# EasyEDA Pro project Instruction_Register.eprj

# Schematic Schematic2
Board Name: Board2; Create Date: 2025-08-15; Page Name: P1; Project Name: Instruction_Register; Schematic Name: Schematic2; Update Date: 2025-08-15; Company: EasyEDA.com; Page Size: A4; Version: V1.0
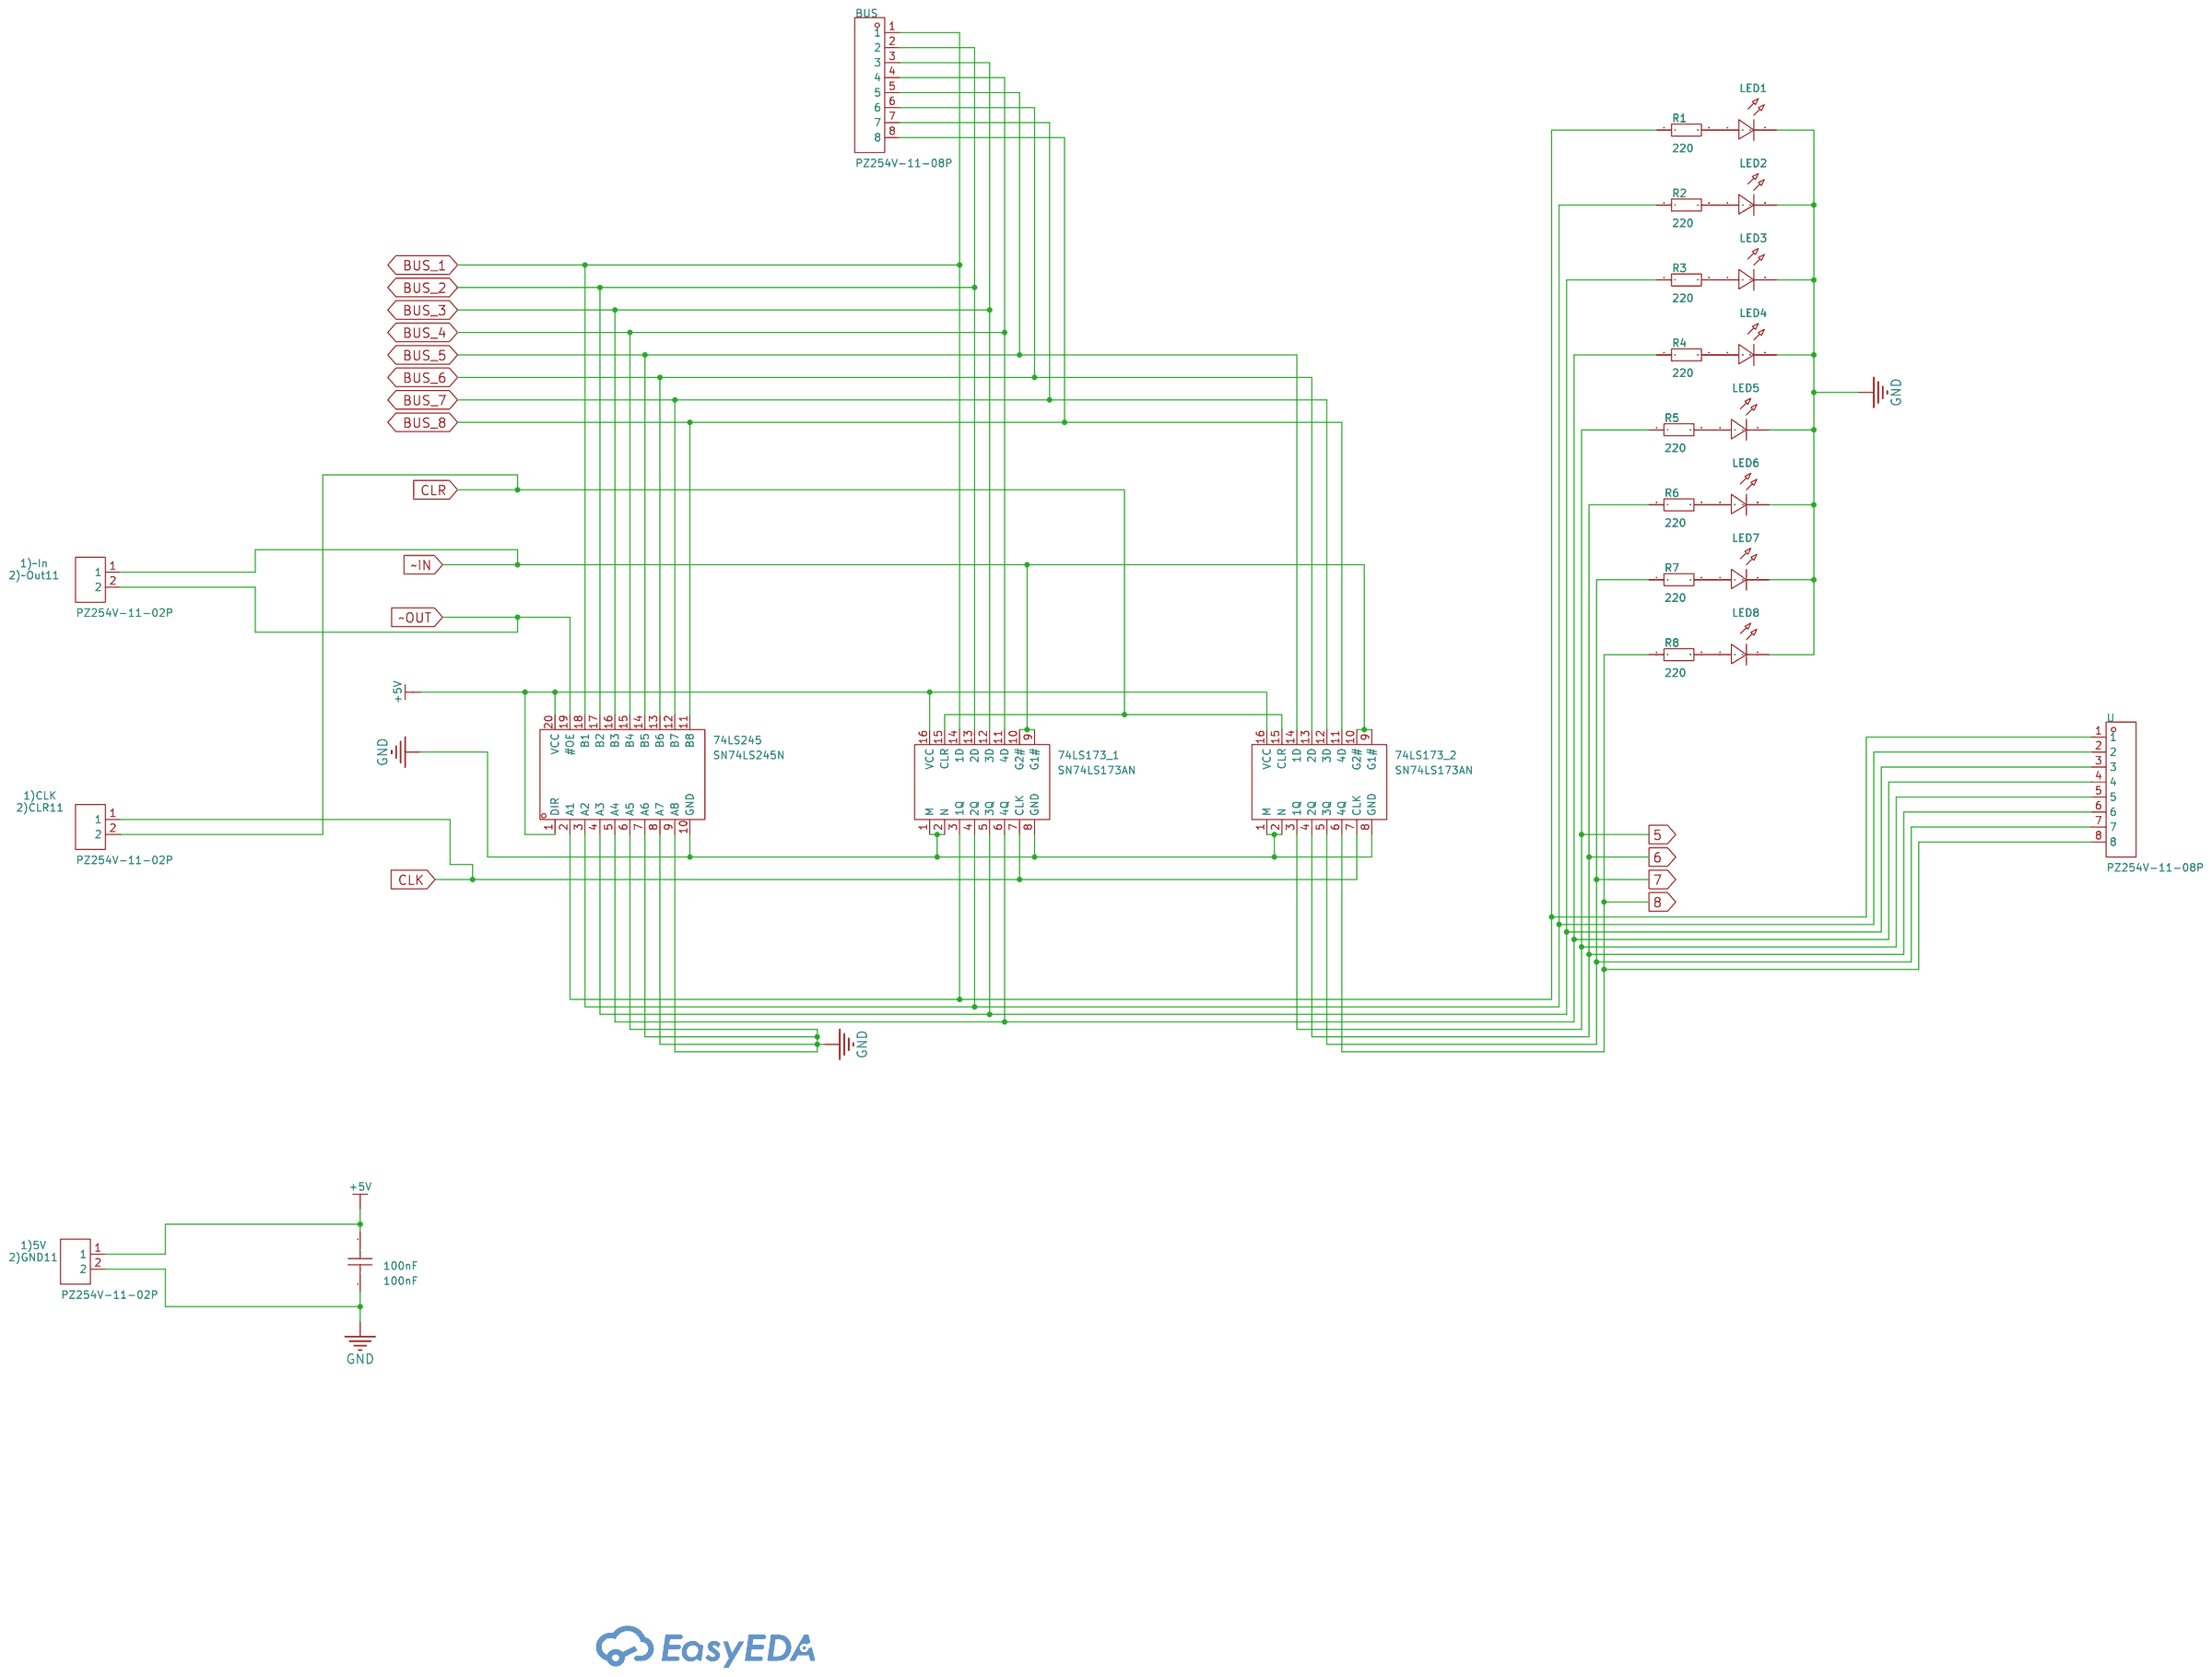
[diagram p0: schematic sheet]

## Parts
1)5V
2)GND11  PZ254V-11-02P  [HDR-TH_2P-P2.54-V-M]
1)CLK
2)CLR11  PZ254V-11-02P  [HDR-TH_2P-P2.54-V-M]
1)~In
2)~Out11  PZ254V-11-02P  [HDR-TH_2P-P2.54-V-M]
74LS173_1  SN74LS173AN  [PDIP-16_L19.3-W6.4-P2.54-LS7.94-BL]
74LS173_2  SN74LS173AN  [PDIP-16_L19.3-W6.4-P2.54-LS7.94-BL]
74LS245  SN74LS245N  [DIP-20_L25.5-W10.0-P2.54-LS7.6-BL]
100nF  100nF  [CAP-TH_L8.5-W5.0-P5.00-D1.2]
BUS  PZ254V-11-08P  [HDR-TH_8P-P2.54-V-M]
LED1  -  [LED-TH_BD5.8-P2.54-FD]
LED2  -  [LED-TH_BD5.8-P2.54-FD]
LED3  -  [LED-TH_BD5.8-P2.54-FD]
LED4  -  [LED-TH_BD5.8-P2.54-FD]
LED5  -  [LED-TH_BD5.8-P2.54-FD]
LED6  -  [LED-TH_BD5.8-P2.54-FD]
LED7  -  [LED-TH_BD5.8-P2.54-FD]
LED8  -  [LED-TH_BD5.8-P2.54-FD]
R1  220  [R_AXIAL-0.4]
R2  220  [R_AXIAL-0.4]
R3  220  [R_AXIAL-0.4]
R4  220  [R_AXIAL-0.4]
R5  220  [R_AXIAL-0.4]
R6  220  [R_AXIAL-0.4]
R7  220  [R_AXIAL-0.4]
R8  220  [R_AXIAL-0.4]
U  PZ254V-11-08P  [HDR-TH_8P-P2.54-V-M]

## Library data of the parts
1)5V
2)GND11 1)CLK
2)CLR11 1)~In
2)~Out11 = PZ254V-11-02P: Pin Structure:1x2P Pitch:2.54mm Row Spacing:- Circluar Pins/Square Pins:Policy Mounting Type:Straight Number of Rows:Single Row Number of Pins:2P Current Rating:- Voltage Rating (Max):- Length of Mating Pin:6mm Insulation Height:2.5mm Length of End Connec; LCSC Part Name: 1x2P 间距:2.54mm 方针 直插; Supplier Part: C492401; Manufacturer: XFCN(兴飞); Supplier Footprint: 插件,P=2.54mm; JLCPCB Part Class: Extended Part; Datasheet: https://atta.szlcsc.com/upload/public/pdf/source/20200309/C492401_A812433581A9B211A7FFA413ADDFF0E5.pdf; Supplier: LCSC; Pin Structure: 1x2P; Pitch: 2.54mm; Circluar Pins/Square Pins: Policy; Mounting Type: Straight; Number of Rows: Single Row; Number of Pins: 2P; Length of Mating Pin: 6mm; Insulation Height: 2.5mm; Length of End Connection Pin: 3mm; Contact Material: Brass; Operating Temperature: -40℃~+105℃; Color: Black
74LS173_1 74LS173_2 = SN74LS173AN: Type:D-Type Trigger Type:Rising Edge Voltage - Supply:4.75V~5.25V Voltage - Supply:4.75V~5.25V Clock Frequency:50MHz Function:Reset Number of Elements:1 Number of Bits per Element:4 Output Type:- Propagation Delay:30ns@5V,45pF Series:74LS Series Current -; Supplier Part: C1550125; Manufacturer: TI(德州仪器); Supplier Footprint: PDIP-16; JLCPCB Part Class: Extended Part; Datasheet: https://www.ti.com/cn/lit/gpn/sn74ls173a; Supplier: LCSC; Type: D-Type; Trigger Type: Rising Edge; Voltage - Supply: 4.75V~5.25V; Clock Frequency: 50MHz; Function: Reset; Number of Elements: 1; Number of Bits per Element: 4; Propagation Delay: 30ns@5V,45pF; Series: 74LS Series; Current - Output Low(IOL): 24mA; Current - Output High(IOH): 2.6mA; Quiescent Current: 24mA; Operating Temperature: 0℃~+70℃
74LS245 = SN74LS245N: output type:Tri-State Voltage - Supply:4.75V~5.25V Voltage - Supply:4.75V~5.25V Number of Elements:1 Number of Bits per Element:8 Current - Output Low(IOL):24mA Current - Output High(IOH):15mA Logic Family:74LS Operating Temperature:0℃~+70℃ Operating Temp; Supplier Part: C352966; Manufacturer: TI(德州仪器); Supplier Footprint: DIP-20; JLCPCB Part Class: Extended Part; Datasheet: https://www.ti.com/cn/lit/gpn/sn74ls245; Supplier: LCSC; output type: Tri-State; Voltage - Supply: 4.75V~5.25V; Number of Elements: 1; Number of Bits per Element: 8; Current - Output Low(IOL): 24mA; Current - Output High(IOH): 15mA; Logic Family: 74LS; Operating Temperature: 0℃~+70℃
100nF = CT4-0805B104K500F3: Capacitance:100nF Tolerance:±10% Tolerance:±10% Voltage Rated: Temperature Coefficient:; LCSC Part Name: 100nF ±10% 50V C3型（直脚）; Supplier Part: C84772; Manufacturer: FH(风华); Supplier Footprint: 插件,P=5.08mm; JLCPCB Part Class: Extended Part; Datasheet: https://atta.szlcsc.com/upload/public/pdf/source/20190402/C385200_059806A6312B28FF1421A2413EB641E1.pdf; Supplier: LCSC; Tolerance: ±10%
BUS U = PZ254V-11-08P: Pin Structure:1x8P Pitch:2.54mm Row Spacing:- Circluar Pins/Square Pins:Square Pins Mounting Type:Straight Number of Rows:Plugin Number of Pins:8P Current Rating (Max):- Voltage Rating (Max):- Length of Mating Pin:6mm Insulation Height:2.5mm Length of End; LCSC Part Name: 间距:2.54mm 1x8P 直插 方针; Supplier Part: C492407; Manufacturer: XFCN(兴飞); Supplier Footprint: 插件,P=2.54mm; JLCPCB Part Class: Extended Part; Datasheet: https://atta.szlcsc.com/upload/public/pdf/source/20200309/C492407_83A6FB26A2233368EDB9516968EC6149.pdf; Supplier: LCSC; Pin Structure: 1x8P; Pitch: 2.54mm; Circluar Pins/Square Pins: Square Pins; Mounting Type: Straight; Number of Rows: Plugin; Number of Pins: 8P; Length of Mating Pin: 6mm; Insulation Height: 2.5mm; Length of End Connection Pin: 3mm; Operating Temperature Range: -40℃~+105℃; Color: Black
LED1-LED8 = LED_TH-R_5mm: Supplier Footprint: Through
R1-R8 = Res_AXIAL-1/4W: Supplier Footprint: Through

## Nets
+5V: 1)5V
2)GND11.1 74LS173_1.16(VCC) 74LS173_2.16(VCC) 74LS245.1(DIR) 74LS245.20(VCC) 100nF.1
GND: 1)5V
2)GND11.2 74LS173_1.1(M) 74LS173_1.2(N) 74LS173_1.8(GND) 74LS173_2.1(M) 74LS173_2.2(N) 74LS173_2.8(GND) 74LS245.6(A5) 74LS245.7(A6) 74LS245.8(A7) 74LS245.9(A8) 74LS245.10(GND) 100nF.2 LED1.2(A) LED2.2(A) LED3.2(A) LED4.2(A) LED5.2(A) LED6.2(A) LED7.2(A) LED8.2(A)
5: 74LS173_2.3(1Q) R5.1 U.5
6: 74LS173_2.4(2Q) R6.1 U.6
7: 74LS173_2.5(3Q) R7.1 U.7
8: 74LS173_2.6(4Q) R8.1 U.8
BUS_1: 74LS173_1.14(1D) 74LS245.18(B1) BUS.1
BUS_2: 74LS173_1.13(2D) 74LS245.17(B2) BUS.2
BUS_3: 74LS173_1.12(3D) 74LS245.16(B3) BUS.3
BUS_4: 74LS173_1.11(4D) 74LS245.15(B4) BUS.4
BUS_5: 74LS173_2.14(1D) 74LS245.14(B5) BUS.5
BUS_6: 74LS173_2.13(2D) 74LS245.13(B6) BUS.6
BUS_7: 74LS173_2.12(3D) 74LS245.12(B7) BUS.7
BUS_8: 74LS173_2.11(4D) 74LS245.11(B8) BUS.8
CLK: 1)CLK
2)CLR11.1 74LS173_1.7(CLK) 74LS173_2.7(CLK)
CLR: 1)CLK
2)CLR11.2 74LS173_1.15(CLR) 74LS173_2.15(CLR)
~IN: 1)~In
2)~Out11.1 74LS173_1.9(G1#) 74LS173_1.10(G2#) 74LS173_2.9(G1#) 74LS173_2.10(G2#)
~OUT: 1)~In
2)~Out11.2 74LS245.19(#OE)
$1N2512: LED1.1(C) R1.2
$1N2517: 74LS173_1.6(4Q) 74LS245.5(A4) R4.1 U.4
$1N2518: 74LS173_1.5(3Q) 74LS245.4(A3) R3.1 U.3
$1N2519: 74LS173_1.4(2Q) 74LS245.3(A2) R2.1 U.2
$1N2520: 74LS173_1.3(1Q) 74LS245.2(A1) R1.1 U.1
$1N2521: LED8.1(C) R8.2
$1N2522: LED7.1(C) R7.2
$1N2523: LED6.1(C) R6.2
$1N2524: LED5.1(C) R5.2
$1N2525: LED4.1(C) R4.2
$1N2526: LED3.1(C) R3.2
$1N2527: LED2.1(C) R2.2

# Board PCB2
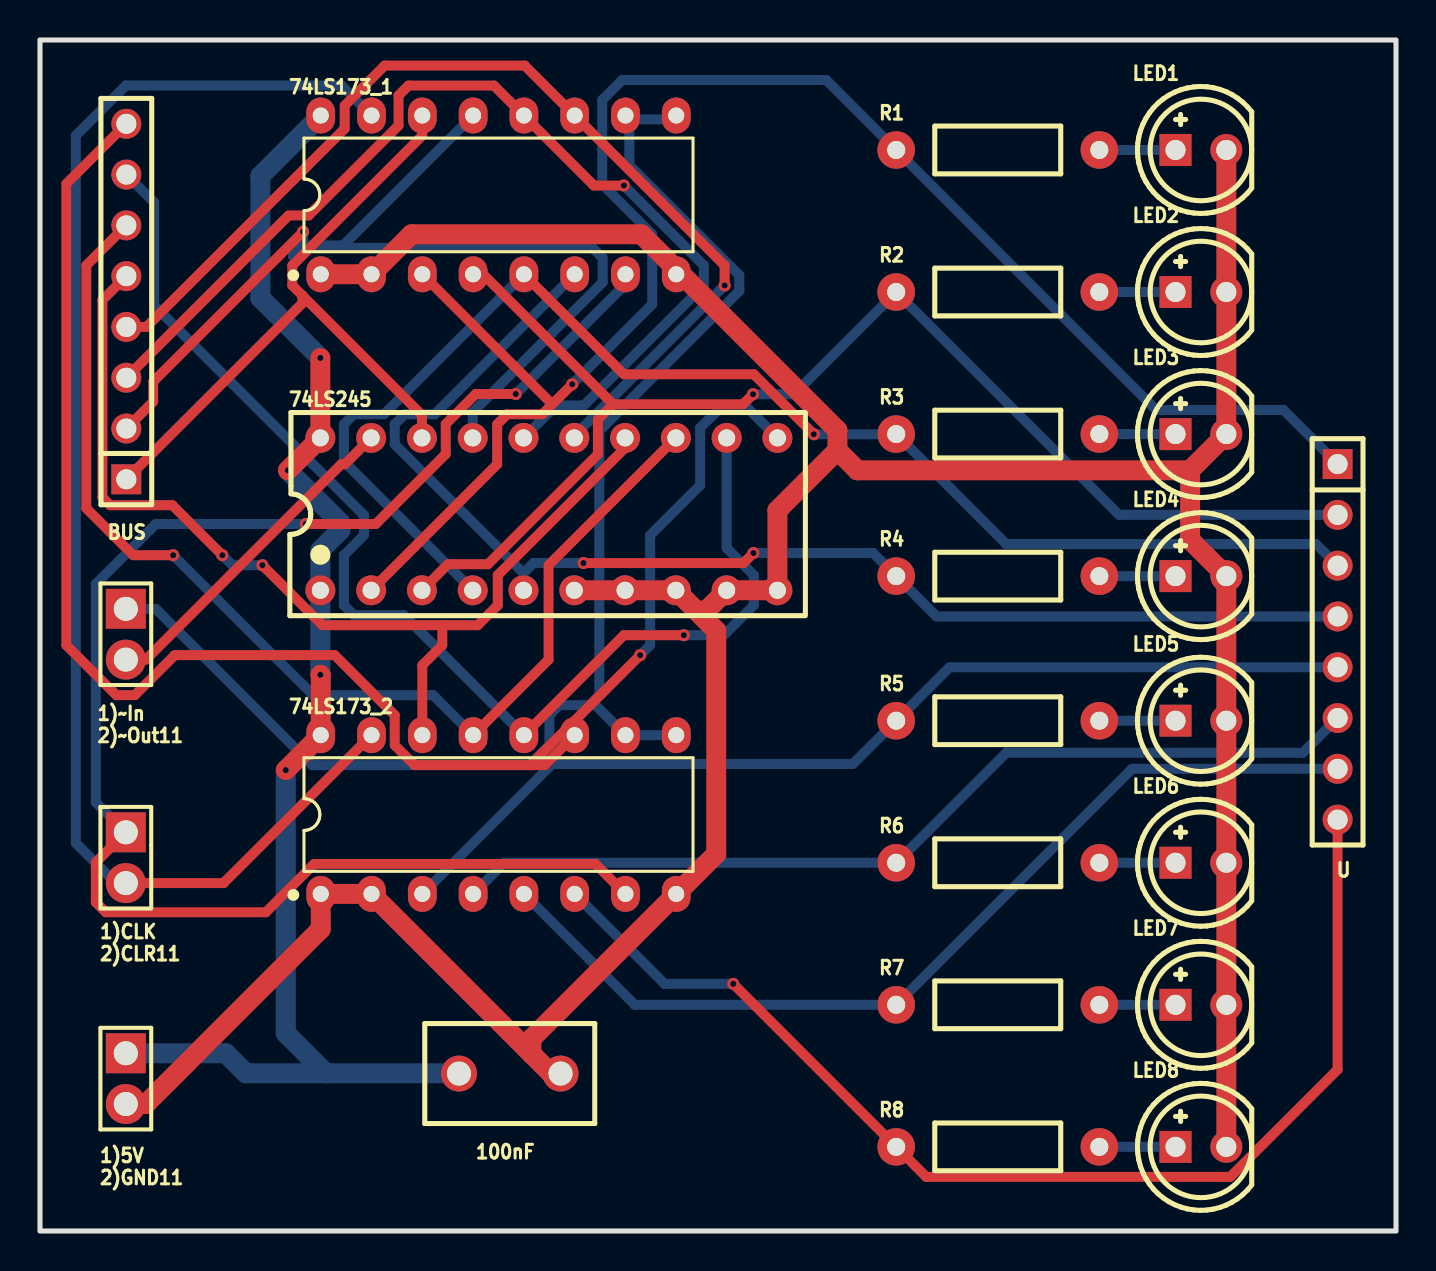
[diagram p1: board, top side]
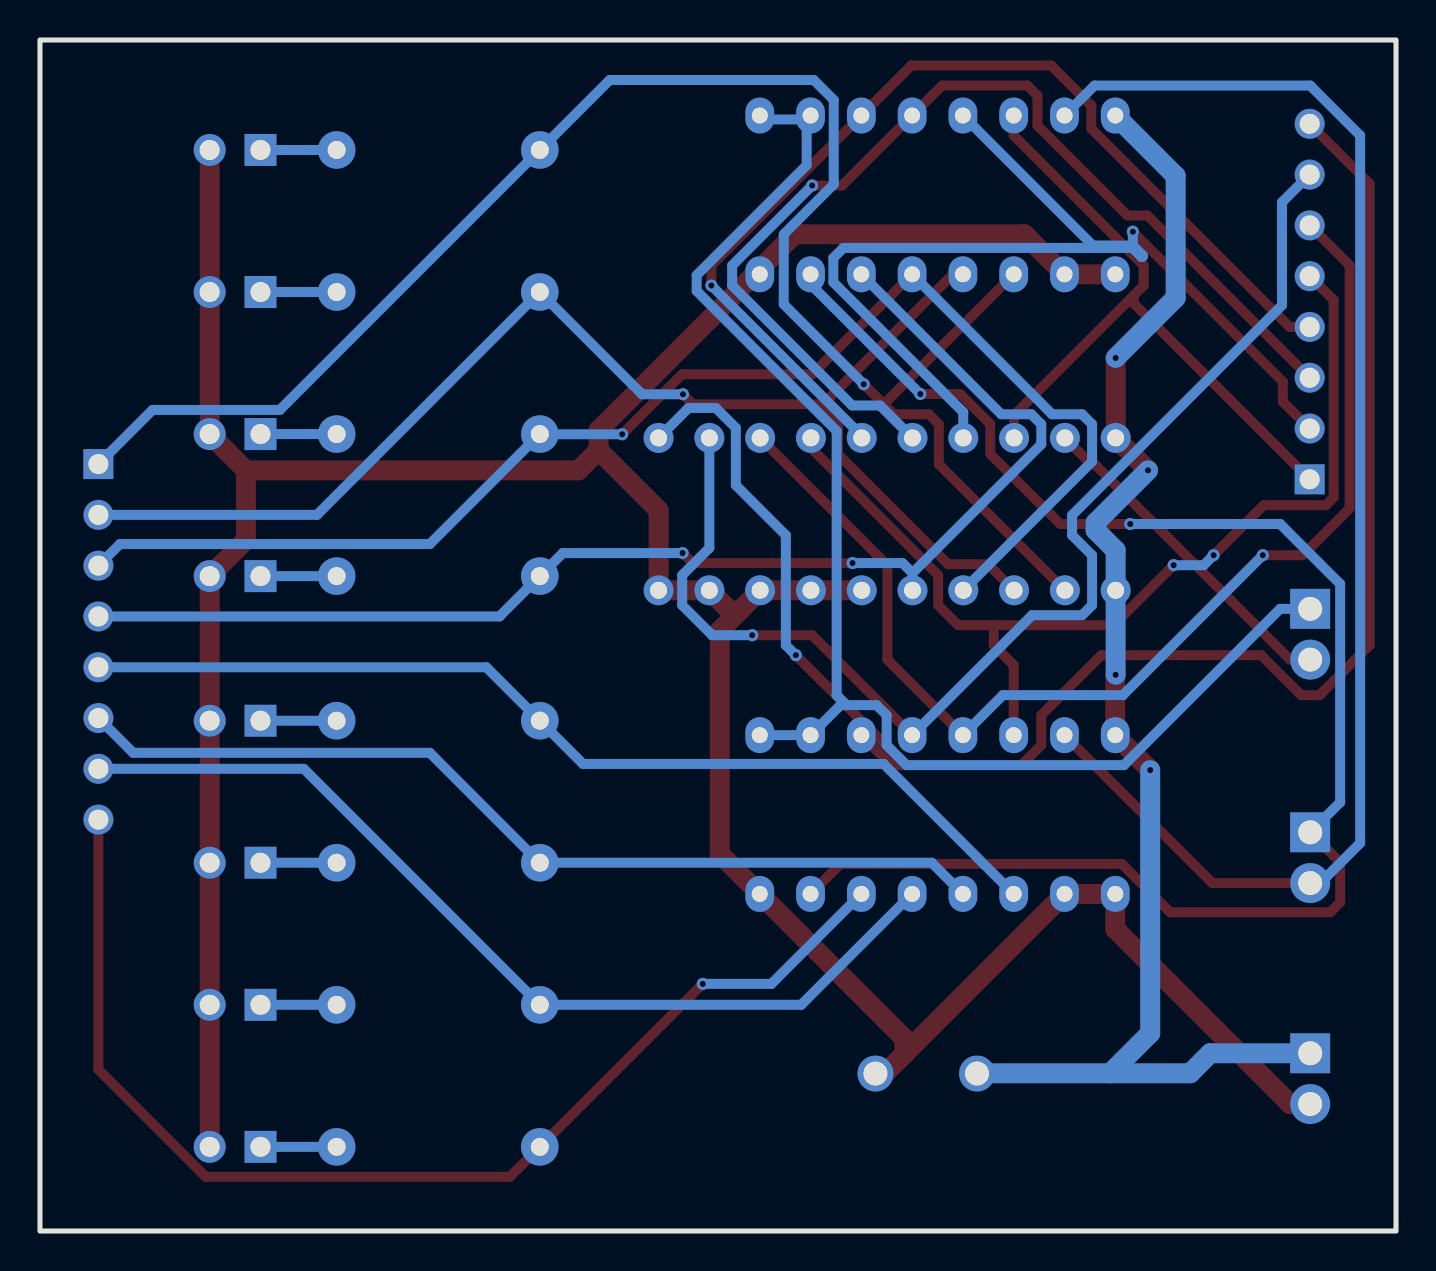
[diagram p2: board, bottom side, seen from below]

Outline 67.82 x 59.56 mm; copper layers: Top Layer, Bottom Layer. Coordinates in mm from the lower left corner of the outline.
Outline path: rectangle 0,59.56 67.82,0
Stack: Top Layer 0.035mm / Dielectric1 1.51mm FR4 er 4.5 / Bottom Layer 0.035mm

## Design rules (mm)
template: Custom Config
spacing copperThickness1oz (default): track to track 0.102, other pairs 0.152 to 0.3
spacing copperThickness2oz: track to track 0.203, other pairs 0.152 to 0.3
track width copperThickness1oz (default): min 0.127, default 0.5, max 2.54
track width copperThickness2oz: min 0.203, default 1, max 2.54
differential pair differentialPair (default): width min 0.127, default 0.254, max 2.54; gap min 0.152, default 0.152
via viaSize (default): diameter min 0.5, default 0.61, max 10; hole min 0.3, default 0.305, max 6.3
net +5V uses copperThickness2oz
net GND uses copperThickness2oz

## Placement (name value [footprint] x y rotation side)
1)5V
2)GND11  PZ254V-11-02P  [HDR-TH_2P-P2.54-V-M]  4.29 7.62 270 top
1)CLK
2)CLR11  PZ254V-11-02P  [HDR-TH_2P-P2.54-V-M]  4.29 18.67 270 top
1)~In
2)~Out11  PZ254V-11-02P  [HDR-TH_2P-P2.54-V-M]  4.29 29.84 270 top
74LS173_1  SN74LS173AN  [PDIP-16_L19.3-W6.4-P2.54-LS7.94-BL]  22.93 51.82 0 top
74LS173_2  SN74LS173AN  [PDIP-16_L19.3-W6.4-P2.54-LS7.94-BL]  22.93 20.83 0 top
74LS245  SN74LS245N  [DIP-20_L25.5-W10.0-P2.54-LS7.6-BL]  25.45 35.85 0 top
100nF  100nF  [CAP-TH_L8.5-W5.0-P5.00-D1.2]  23.5 7.87 0 top
BUS  PZ254V-11-08P  [HDR-TH_8P-P2.54-V-M]  4.32 46.48 90 top
LED1  -  [LED-TH_BD5.8-P2.54-FD]  58.06 54.06 0 top
LED2  -  [LED-TH_BD5.8-P2.54-FD]  58.06 46.96 0 top
LED3  -  [LED-TH_BD5.8-P2.54-FD]  58.06 39.85 0 top
LED4  -  [LED-TH_BD5.8-P2.54-FD]  58.06 32.75 0 top
LED5  -  [LED-TH_BD5.8-P2.54-FD]  58.06 25.52 0 top
LED6  -  [LED-TH_BD5.8-P2.54-FD]  58.06 18.42 0 top
LED7  -  [LED-TH_BD5.8-P2.54-FD]  58.06 11.31 0 top
LED8  -  [LED-TH_BD5.8-P2.54-FD]  58.06 4.21 0 top
R1  220  [R_AXIAL-0.4]  47.9 54.06 0 top
R2  220  [R_AXIAL-0.4]  47.9 46.96 0 top
R3  220  [R_AXIAL-0.4]  47.9 39.85 0 top
R4  220  [R_AXIAL-0.4]  47.9 32.75 0 top
R5  220  [R_AXIAL-0.4]  47.9 25.52 0 top
R6  220  [R_AXIAL-0.4]  47.9 18.42 0 top
R7  220  [R_AXIAL-0.4]  47.9 11.31 0 top
R8  220  [R_AXIAL-0.4]  47.9 4.21 0 top
U  PZ254V-11-08P  [HDR-TH_8P-P2.54-V-M]  64.9 29.46 270 top

## Footprints (pads in the part's own frame, mm; a bottom-side part is the same pattern mirrored in y, then rotated)
CAP-TH_L8.5-W5.0-P5.00-D1.2
  round 1.8 hole 1.2: 1(-2.54,0) 2(2.54,0)
DIP-20_L25.5-W10.0-P2.54-LS7.6-BL
  round 1.5 hole 0.85: 1(-11.43,-3.81) 2(-8.89,-3.81) 3(-6.35,-3.81) 4(-3.81,-3.81) 5(-1.27,-3.81) 6(1.27,-3.81) 7(3.81,-3.81) 8(6.35,-3.81) 9(8.89,-3.81) 10(11.43,-3.81) 11(11.43,3.81) 12(8.89,3.81) 13(6.35,3.81) 14(3.81,3.81) 15(1.27,3.81) 16(-1.27,3.81) 17(-3.81,3.81) 18(-6.35,3.81) 19(-8.89,3.81) 20(-11.43,3.81)
HDR-TH_2P-P2.54-V-M
  rect 2x2 hole 1.2: 1(-1.27,0)
  round 2 hole 1.2: 2(1.27,0)
HDR-TH_8P-P2.54-V-M
  rect 1.5x1.5 hole 1: 1(-8.89,0)
  round 1.5 hole 1: 2(-6.35,0) 3(-3.81,0) 4(-1.27,0) 5(1.27,0) 6(3.81,0) 7(6.35,0) 8(8.89,0)
LED-TH_BD5.8-P2.54-FD
  rect 1.6x1.6 hole 1: 1(-1.27,0)
  round 1.6 hole 1: 2(1.27,0)
PDIP-16_L19.3-W6.4-P2.54-LS7.94-BL
  oval 1.44x1.8 hole 0.8: 1(-8.89,-3.97) 2(-6.35,-3.97) 3(-3.81,-3.97) 4(-1.27,-3.97) 5(1.27,-3.97) 6(3.81,-3.97) 7(6.35,-3.97) 8(8.89,-3.97) 9(8.89,3.97) 10(6.35,3.97) 11(3.81,3.97) 12(1.27,3.97) 13(-1.27,3.97) 14(-3.81,3.97) 15(-6.35,3.97) 16(-8.89,3.97)
R_AXIAL-0.4
  round 1.879 hole 0.899: 1(-5.08,0) 2(5.08,0)

## Nets
As in the schematic.

## Via types
v1: diameter 0.61, hole 0.305, Top Layer to Bottom Layer, 20 vias

## Routing (per net, layer and track width the routed paths; a pad name or vN(x,y) marks a point on that pad's centre or on a via; arc(x,y) is an arc through that point)
+5V: length 71.2
  Top Layer w1: v1(12.4,38.04) 74LS245.20 v1(14.02,43.66) ; v1(14.02,27.82) 14.04,27.8 74LS173_2.16 v1(12.29,23.05)
  Bottom Layer w1: v1(12.29,23.05) 12.29,9.89 14.29,7.89 ; 14.29,7.89 10.29,7.89 9.29,8.89 1)5V
2)GND11.1 ; 14.29,7.89 20.94,7.89 100nF.1 ; v1(12.4,38.04) 15.02,35.42 15.02,35.04 14.02,34.04 74LS245.1 v1(14.02,27.82) ; 74LS173_1.16 11.02,52.77 11.02,46.66 v1(14.02,43.66)
GND: length 177.9
  Top Layer w1: LED8.2 LED7.2 LED6.2 LED5.2 LED4.2 57.52,34.56 57.52,38.04 ; 24.58,8.86 24.58,9.62 74LS173_2.8 33.82,18.86 33.82,30.02 32.82,31.02 ; 24.58,8.86 74LS173_2.2 74LS173_2.1 14.04,15.1 5.29,6.35 1)5V
2)GND11.2 ; 24.58,8.86 25.56,7.87 100nF.2 ; 32.82,31.02 74LS245.8 74LS245.7 74LS245.6 ; 32.82,31.02 33.32,31.02 74LS245.9 74LS245.10 36.88,36.04 39.88,39.04 ; 39.88,39.04 40.88,38.04 57.52,38.04 ; 39.88,39.04 39.88,40.04 32.08,47.85 ; 32.08,47.85 74LS173_1.8 ; 32.08,47.85 30.08,49.85 18.58,49.85 74LS173_1.2 74LS173_1.1 ; 57.52,38.04 LED3.2 LED2.2 LED1.2
5: length 50.5
  Bottom Layer w0.5: 74LS173_2.3 25.62,23.36 40.66,23.36 R5.1 45.5,28.19 U.5
6: length 46.9
  Bottom Layer w0.5: 74LS173_2.4 23.22,18.42 R6.1 48.32,23.92 63.16,23.92 U.6
7: length 47.9
  Bottom Layer w0.5: U.7 54.62,23.11 R7.1 29.75,11.31 74LS173_2.5
8: length 58.7
  Top Layer w0.5: v1(34.67,12.36) R8.1 44.32,2.71 59.53,2.71 64.9,8.07 U.8
  Bottom Layer w0.5: 74LS173_2.6 31.24,12.36 v1(34.67,12.36)
BUS_1: length 34.3
  Top Layer w0.5: 74LS245.18 19.1,40.8 13.12,46.79 ; 74LS173_1.14 19.12,54.79 12.62,48.29 12.62,47.29 13.12,46.79 ; 13.12,46.79 13.12,46.39 BUS.1
BUS_2: length 53.9
  Top Layer w0.5: BUS.2 5.66,41.47 5.66,42.47 v1(13.16,49.97)
  Bottom Layer w0.5: 13.16,49.14 13.18,49.16 27.64,49.16 28.14,48.66 28.14,47.45 21.64,40.95 74LS245.17 ; 13.16,49.14 12.74,48.72 12.69,48.72 12.66,48.74 12.66,48.79 13.16,49.29 ; 13.16,49.14 13.16,49.29 ; 13.16,49.29 v1(13.16,49.97) ; 13.16,49.29 15.16,49.29 74LS173_1.13
BUS_3: length 52.7
  Top Layer w0.5: BUS.3 12.43,50.79 13.43,50.79 17.93,55.29 17.93,56.79 18.43,57.29 22.7,57.29 74LS173_1.12 27.7,52.29 v1(29.2,52.29)
  Bottom Layer w0.5: v1(29.2,52.29) 33.2,48.29 33.2,47.29 27.2,41.29 25.8,41.29 74LS245.16
BUS_4: length 51.9
  Top Layer w0.5: v1(34.24,47.29) 34.24,48.29 74LS173_1.11 24.24,58.29 17.24,58.29 15.24,56.29 15.24,55.13 5.32,45.21 BUS.4
  Bottom Layer w0.5: 74LS245.15 26.72,39.77 v1(34.24,47.29)
BUS_5: length 51.3
  Top Layer w0.5: v1(11.12,33.3) 14.12,30.3 20.12,30.3 ; 20.12,30.3 20.12,29.3 19.12,28.3 74LS173_2.14 ; 20.12,30.3 21.9,30.3 22.9,31.3 22.9,32.8 29.26,39.16 74LS245.14 ; v1(9.12,33.8) 6.62,36.3 3.51,36.3 3.12,36.69 3.12,46.55 BUS.5
  Bottom Layer w0.5: v1(11.12,33.3) 9.62,33.3 v1(9.12,33.8)
BUS_6: length 58.1
  Top Layer w0.5: v1(6.66,33.8) 4.66,33.8 2.32,36.14 2.32,48.29 BUS.6 ; 74LS173_2.13 25.44,28.57 25.44,33.3 74LS245.13
  Bottom Layer w0.5: v1(6.66,33.8) 13.66,26.8 19.66,26.8 74LS173_2.13
BUS_7: length 61.7
  Top Layer w0.5: 74LS173_2.12 29.2,29.8 v1(32.2,29.8)
  Bottom Layer w0.5: BUS.7 5.7,51.45 5.7,46.3 16.2,35.8 16.2,34.8 15.2,33.8 15.2,31.3 15.7,30.8 18.2,30.8 74LS173_2.12 ; v1(32.2,29.8) 34.2,29.8 35.7,31.3 35.7,32.8 34.34,34.16 74LS245.12
BUS_8: length 83.7
  Top Layer w0.5: 24.52,23.3 v1(30.02,28.8) ; 24.52,23.3 25.24,23.3 74LS173_2.11 ; 24.52,23.3 18.74,23.3 17.74,24.3 17.74,25.8 14.74,28.8 6.74,28.8 4.74,26.8 3.82,26.8 1.32,29.3 1.32,52.37 BUS.8
  Bottom Layer w0.5: 74LS245.11 35.38,41.16 34.02,41.16 33.02,40.16 33.02,37.3 30.52,34.8 30.52,29.3 v1(30.02,28.8)
CLK: length 79.6
  Top Layer w0.5: 1)CLK
2)CLR11.1 2.79,18.44 2.79,16.44 3.29,15.94 11.29,15.94 13.71,18.36 27.78,18.36 74LS173_2.7 ; v1(23.79,41.86) 21.79,41.86 20.29,40.36 20.29,38.86 16.79,35.36 v1(13.29,35.36)
  Bottom Layer w0.5: v1(13.29,35.36) 5.79,35.36 2.79,32.36 2.79,21.44 1)CLK
2)CLR11.1 ; v1(23.79,41.86) 29.28,47.35 74LS173_1.7
CLR: length 70.5
  Top Layer w0.5: 1)CLK
2)CLR11.2 9.18,17.4 74LS173_2.15
  Bottom Layer w0.5: 1)CLK
2)CLR11.2 3.79,17.4 1.79,19.4 1.79,54.79 4.29,57.29 15.08,57.29 74LS173_1.15
~IN: length 70.9
  Bottom Layer w0.5: 27.48,26.3 25.98,26.3 25.48,25.8 25.48,24.3 24.48,23.3 13.61,23.3 5.79,31.11 1)~In
2)~Out11.1 ; 27.48,26.3 27.98,26.8 27.98,40.01 34.98,47.01 34.98,47.8 29.48,53.3 29.48,55.59 ; 27.48,26.3 27.78,26.3 74LS173_2.10 74LS173_2.9 ; 74LS173_1.9 31.63,55.59 29.48,55.59 ; 29.48,55.59 74LS173_1.10
~OUT: length 16.9
  Top Layer w0.5: 74LS245.19 15.24,38.34 15.06,38.34 5.29,28.58 1)~In
2)~Out11.2
$1N2512: length 3.8
  Bottom Layer w0.5: LED1.1 R1.2
$1N2517: length 65.5
  Top Layer w0.5: v1(27.18,33.41) 35.18,33.41 v1(35.68,33.91)
  Bottom Layer w0.5: 24.18,32.91 17.74,39.35 17.74,40.35 18.24,40.85 19.74,40.85 74LS173_1.6 ; 24.18,32.91 24.68,33.41 v1(27.18,33.41) ; 24.18,32.91 74LS245.5 ; v1(35.68,33.91) 41.67,33.91 R4.1 44.84,30.73 U.4
$1N2518: length 69.8
  Top Layer w0.5: v1(38.7,39.85) 35.7,42.85 29.2,42.85 74LS173_1.5
  Bottom Layer w0.5: U.3 63.82,34.35 48.32,34.35 R3.1 42.81,39.85 v1(38.7,39.85) ; 74LS245.4 15.2,38.48 15.2,40.35 15.7,40.85 17.2,40.85 74LS173_1.5
$1N2519: length 67.3
  Top Layer w0.5: 74LS173_1.4 22.16,47.85 28.66,41.35 ; 28.66,41.35 27.9,40.59 27.9,38.85 22.4,33.35 20.4,33.35 74LS245.3 ; 28.66,41.35 35.16,41.35 v1(35.66,41.85)
  Bottom Layer w0.5: U.2 53.97,35.81 R2.1 37.71,41.85 v1(35.66,41.85)
$1N2520: length 86.7
  Top Layer w0.5: 74LS173_1.3 25.62,41.35 ; 25.62,41.35 25.12,40.85 23.36,40.85 22.86,40.35 22.86,38.35 74LS245.2 ; 25.62,41.35 v1(26.62,42.35)
  Bottom Layer w0.5: v1(26.62,42.35) 30.62,46.35 30.62,49.85 28.12,52.35 28.12,56.56 29.12,57.56 39.32,57.56 R1.1 55.82,41.06 62.19,41.06 U.1
$1N2521: length 3.8
  Bottom Layer w0.5: LED8.1 R8.2
$1N2522: length 3.8
  Bottom Layer w0.5: LED7.1 R7.2
$1N2523: length 3.8
  Bottom Layer w0.5: LED6.1 R6.2
$1N2524: length 3.8
  Bottom Layer w0.5: LED5.1 R5.2
$1N2525: length 3.8
  Bottom Layer w0.5: LED4.1 R4.2
$1N2526: length 3.8
  Bottom Layer w0.5: LED3.1 R3.2
$1N2527: length 3.8
  Bottom Layer w0.5: LED2.1 R2.2
